# EAGLE design playa (EAGLE 6.4)
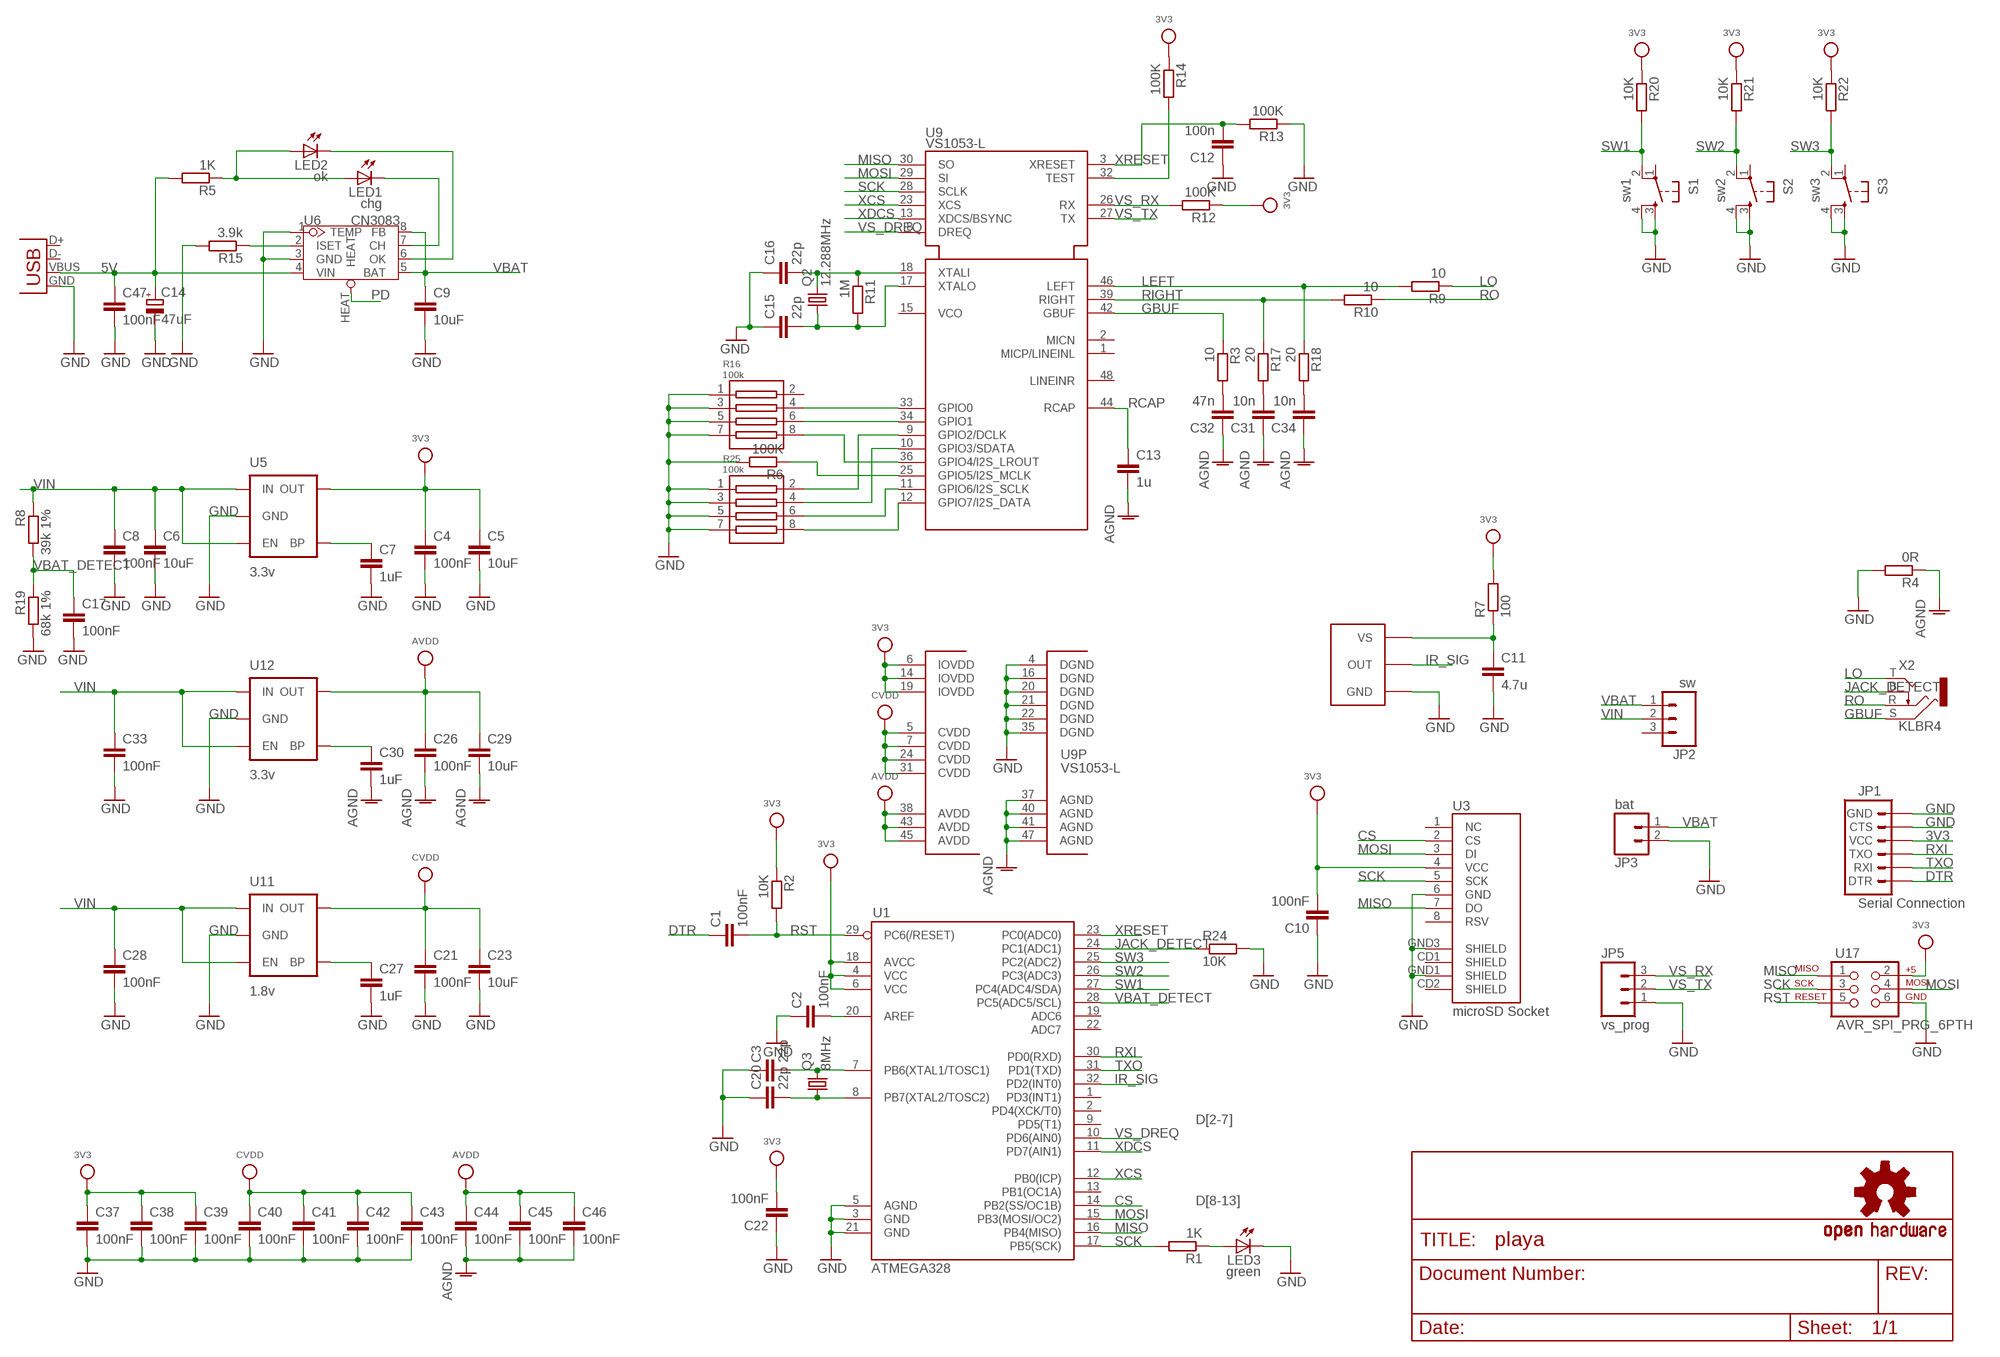
[diagram p0: schematic, sheet 1]

## Parts
C1  100nF  C-EUC0805  [C0805]
C2  100nF  C-EUC0805  [C0805]
C3  22p  C-EUC0805  [C0805]
C4  100nF  C-EUC0805  [C0805]
C5  10uF  C-EUC1206  [C1206]
C6  10uF  C-EUC1206  [C1206]
C7  1uF  C-EUC0805  [C0805]
C8  100nF  C-EUC0805  [C0805]
C9  10uF  C-EUC1206  [C1206]
C10  100nF  C-EUC0805  [C0805]
C11  4.7u  C-EUC1206  [C1206]
C12  100n  C-EUC0805  [C0805]
C13  1u  C-EUC0805  [C0805]
C14  47uF  CPOL-EUCT7343  [CT7343]
C15  22p  C-EUC0805  [C0805]
C16  22p  C-EUC0805  [C0805]
C17  100nF  C-EUC0805  [C0805]
C20  22p  C-EUC0805  [C0805]
C21  100nF  C-EUC0805  [C0805]
C22  100nF  C-EUC0805  [C0805]
C23  10uF  C-EUC1206  [C1206]
C26  100nF  C-EUC0805  [C0805]
C27  1uF  C-EUC0805  [C0805]
C28  100nF  C-EUC0805  [C0805]
C29  10uF  C-EUC1206  [C1206]
C30  1uF  C-EUC0805  [C0805]
C31  10n  C-EUC0805  [C0805]
C32  47n  C-EUC0805  [C0805]
C33  100nF  C-EUC0805  [C0805]
C34  10n  C-EUC0805  [C0805]
C37  100nF  C-EUC0805  [C0805]
C38  100nF  C-EUC0805  [C0805]
C39  100nF  C-EUC0805  [C0805]
C40  100nF  C-EUC0805  [C0805]
C41  100nF  C-EUC0805  [C0805]
C42  100nF  C-EUC0805  [C0805]
C43  100nF  C-EUC0805  [C0805]
C44  100nF  C-EUC0805  [C0805]
C45  100nF  C-EUC0805  [C0805]
C46  100nF  C-EUC0805  [C0805]
C47  100nF  C-EUC0805  [C0805]
JP1  Serial Connection  ARDUINO_SERIAL_PROGRAMPTH  [1X06]
JP2  sw  M03PTH  [1X03]
JP3  bat  M02PTH  [1X02]
JP5  vs_prog  M03PTH  [1X03]
LED1  chg  LEDCHIP-LED0805  [CHIP-LED0805]
LED2  ok  LEDCHIP-LED0805  [CHIP-LED0805]
LED3  green  LEDCHIP-LED0805  [CHIP-LED0805]
Q2  12.288MHz  CRYTAL  [CRYSTAL_5X3.2]
Q3  8MHz  CRYTAL  [CRYSTAL_5X3.2]
R1  1K  R-EU_R0805W  [R0805W]
R2  10K  R-EU_R0805W  [R0805W]
R3  10  R-EU_R0805W  [R0805W]
R4  0R  R-EU_R0805W  [R0805W]
R5  1K  R-EU_R0805W  [R0805W]
R6  100K  R-EU_R0805W  [R0805W]
R7  100  R-EU_R0805W  [R0805W]
R8  39k 1%  R-EU_R0805W  [R0805W]
R9  10  R-EU_R0805W  [R0805W]
R10  10  R-EU_R0805W  [R0805W]
R11  1M  R-EU_R0805W  [R0805W]
R12  100K  R-EU_R0805W  [R0805W]
R13  100K  R-EU_R0805W  [R0805W]
R14  100K  R-EU_R0805W  [R0805W]
R15  3.9k  R-EU_R0805W  [R0805W]
R16  100k  RES_ARR_1206  [RAS_ARR_1206]
R17  20  R-EU_R0805W  [R0805W]
R18  20  R-EU_R0805W  [R0805W]
R19  68k 1%  R-EU_R0805W  [R0805W]
R20  10K  R-EU_R0805W  [R0805W]
R21  10K  R-EU_R0805W  [R0805W]
R22  10K  R-EU_R0805W  [R0805W]
R24  10K  R-EU_R0805W  [R0805W]
R25  100k  RES_ARR_1206  [RAS_ARR_1206]
S1  sw1  TAC_SWITCHSMD  [TACTILE_SWITCH_SMD]
S2  sw2  TAC_SWITCHSMD  [TACTILE_SWITCH_SMD]
S3  sw3  TAC_SWITCHSMD  [TACTILE_SWITCH_SMD]
U1  ATMEGA328  ATMEGA168  [TQFP32-08]
U3  microSD Socket  USD-SOCKETNEW  [MICRO-SD-SOCKET-PP]
U5  3.3v  V_REG_LDOSMD  [SOT23-5]
U6  CN3083  [SOP8-W/-HEAT]
U9  VS1053-L  [LQFP48]
U11  1.8v  V_REG_LDOSMD  [SOT23-5]
U12  3.3v  V_REG_LDOSMD  [SOT23-5]
U17  AVR_SPI_PRG_6PTH  [2X3]
U$3  TSOP312X  [TSOP312X]
U$5  OSHW-LOGOM  [OSHW-LOGO-M]
X1  USBSMD  [USB-MINIB]
X2  KLBR4  [KLBR4]

## Nets
3V3: C4.1 C5.1 C10.2 C22.2 C37.1 C38.1 C39.1 JP1.4(VCC) R2.1 R7.2 R12.1 R14.1 R20.1 R21.1 R22.1 U1.4(VCC) U1.6(VCC) U1.18(AVCC) U3.4(VCC) U5.5(OUT) U9.6(IOVDD) U9.14(IOVDD) U9.19(IOVDD) U17.2
5V: C14.+ C47.1 R5.2 U6.4(VIN) X1.VBUS
AGND [vcc]: C13.2 C26.2 C29.2 C30.2 C31.1 C32.1 C34.1 C44.2 C45.2 C46.2 R4.1 U9.37(AGND) U9.40(AGND) U9.41(AGND) U9.47(AGND)
AVDD: C26.1 C29.1 C44.1 C45.1 C46.1 U9.38(AVDD) U9.43(AVDD) U9.45(AVDD) U12.5(OUT)
CS: U1.14(PB2(SS/OC1B)) U3.2(CS)
CVDD: C21.1 C23.1 C40.1 C41.1 C42.1 C43.1 U9.5(CVDD) U9.7(CVDD) U9.24(CVDD) U9.31(CVDD) U11.5(OUT)
DTR: C1.1 JP1.1(DTR)
GBUF: R3.1 U9.42(GBUF) X2.S
GND [vcc]: C2.1 C3.1 C4.2 C5.2 C6.2 C7.2 C8.2 C9.2 C10.1 C11.2 C12.1 C14.- C15.1 C16.1 C17.2 C20.1 C21.2 C22.1 C23.2 C27.2 C28.2 C33.2 C37.2 C38.2 C39.2 C40.2 C41.2 C42.2 C43.2 C47.2 JP1.5(CTS) JP1.6(GND) JP3.2 JP5.1 LED3.C R4.2 R6.2 R13.1 R15.2 R16.1 R16.3 R16.5 R16.7 R19.2 R24.2 R25.1 R25.3 R25.5 R25.7 S1.3 S1.4 S2.3 S2.4 S3.3 S3.4 U1.3(GND) U1.5(AGND) U1.21(GND) U3.6(GND) U3.GND1(SHIELD) U3.GND3(SHIELD) U5.2(GND) U6.1(TEMP) U6.3(GND) U9.4(DGND) U9.16(DGND) U9.20(DGND) U9.21(DGND) U9.22(DGND) U9.35(DGND) U11.2(GND) U12.2(GND) U17.6 U$3.1(GND) X1.GND
IR_SIG: U1.32(PD2(INT0)) U$3.3(OUT)
JACK_DETECT: R24.1 U1.24(PC1(ADC1)) X2.B
LEFT: R9.2 R18.1 U9.46(LEFT)
LO: R9.1 X2.T
MISO: U1.16(PB4(MISO)) U3.7(DO) U9.30(SO) U17.1
MOSI: U1.15(PB3(MOSI/OC2)) U3.3(DI) U9.29(SI) U17.4
N$1: C20.2 Q3.P$1 U1.8(PB7(XTAL2/TOSC2))
N$2: C3.2 Q3.P$2 U1.7(PB6(XTAL1/TOSC1))
N$3: C2.2 U1.20(AREF)
N$4: R16.4 U9.33(GPIO0)
N$5: C7.1 U5.4(BP)
N$6: R25.8 U9.12(GPIO7/I2S_DATA)
N$7: C27.1 U11.4(BP)
N$8: C32.2 R3.2
N$9: R15.1 U6.2(ISET)
N$10: C31.2 R17.2
N$11: C34.2 R18.2
N$12: R16.6 U9.34(GPIO1)
N$13: LED3.A R1.1
N$14: LED1.A LED2.A R5.1
N$15: LED1.C U6.7(CH)
N$16: LED2.C U6.6(OK)
N$17: R16.8 U9.36(GPIO4/I2S_LROUT)
N$19: C30.1 U12.4(BP)
N$20: R6.1 U9.25(GPIO5/I2S_MCLK)
N$21: R25.2 U9.9(GPIO2/DCLK)
N$22: R25.4 U9.10(GPIO3/SDATA)
N$23: R25.6 U9.11(GPIO6/I2S_SCLK)
N$24: C11.1 R7.1 U$3.2(VS)
N$47: R14.2 U9.32(TEST)
PD: U6.HEAT
RCAP: C13.1 U9.44(RCAP)
RIGHT: R10.2 R17.1 U9.39(RIGHT)
RO: R10.1 X2.R
RST: C1.2 R2.2 U1.29(PC6(/RESET)) U17.5
RXI: JP1.3(TXO) U1.30(PD0(RXD))
SCK: R1.2 U1.17(PB5(SCK)) U3.5(SCK) U9.28(SCLK) U17.3
SW1: R20.2 S1.2 U1.27(PC4(ADC4/SDA))
SW2: R21.2 S2.2 U1.26(PC3(ADC3))
SW3: R22.2 S3.2 U1.25(PC2(ADC2))
TXO: JP1.2(RXI) U1.31(PD1(TXD))
VBAT: C9.1 JP2.1 JP3.1 U6.5(BAT) U6.8(FB)
VBAT_DETECT: C17.1 R8.2 R19.1 U1.28(PC5(ADC5/SCL))
VIN: C6.1 C8.1 C28.1 C33.1 JP2.2 R8.1 U5.1(IN) U5.3(EN) U11.1(IN) U11.3(EN) U12.1(IN) U12.3(EN)
VS_DREQ: U1.10(PD6(AIN0)) U9.8(DREQ)
VS_RX: JP5.3 R12.2 U9.26(RX)
VS_TX: JP5.2 U9.27(TX)
VS_XTALI: C16.2 Q2.P$2 R11.1 U9.18(XTALI)
VS_XTALO: C15.2 Q2.P$1 R11.2 U9.17(XTALO)
XCS: U1.12(PB0(ICP)) U9.23(XCS)
XDCS: U1.11(PD7(AIN1)) U9.13(XDCS/BSYNC)
XRESET: C12.2 R13.2 U1.23(PC0(ADC0)) U9.3(XRESET)
Unconnected: JP2.3 R16.2 S1.1 S2.1 S3.1 U1.1(PD3(INT1)) U1.2(PD4(XCK/T0)) U1.9(PD5(T1)) U1.13(PB1(OC1A)) U1.19(ADC6) U1.22(ADC7) U3.1(NC) U3.8(RSV) U3.CD1(SHIELD) U3.CD2(SHIELD) U9.1(MICP/LINEINL) U9.2(MICN) U9.15(VCO) U9.48(LINEINR) X1.D+ X1.D-

## Notes on the sheet
- D[2-7]
- D[8-13]

## Library data of the parts
C1-C13 C15-C17 C20-C23 C26-C34 C37-C47 = rcl:C-EU: CAPACITOR, European symbol
C14 = rcl:CPOL-EU: POLARIZED CAPACITOR, European symbol
JP1 = SparkFun:ARDUINO_SERIAL_PROGRAM
JP2 JP5 = SparkFun:M03: Header 3 Standard 3-pin 0.1" header. Use with straight break away headers (SKU : PRT-00116), right angle break away headers (PRT-00553), swiss pins (PRT-00743), machine pins (PRT-00117), and female headers (PRT-00115). Molex polarized connector foot print use with SKU : PRT-08232 with associated crimp pins and housings.
JP3 = SparkFun:M02: Header 2 Standard 2-pin 0.1" header. Use with straight break away headers (SKU : PRT-00116), right angle break away headers (PRT-00553), swiss pins (PRT-00743), machine pins (PRT-00117), and female headers (PRT-00115). Molex polarized connector foot print use with SKU : PRT-08233 with associated crimp pins and housings.
LED1-LED3 = led:LED: LED OSRAM: - CHIPLED LG R971, LG N971, LY N971, LG Q971, LY Q971, LO R971, LY R971 LH N974, LH R974 LS Q976, LO Q976, LY Q976 LO Q996 - Hyper CHIPLED LW Q18S LB Q993, LB Q99A, LB R99A - SideLED LS A670, LO A670, LY A670, LG A670, LP A670 LB A673, LV A673, LT A673, LW A673 LH A674 LY A675 LS A676, LA A676, LO A676, LY A676, LW A676 LS A679, LY A679, LG A679 - Hyper Micro SIDELED® LS Y876, LA Y876, LO Y876, LY Y876 LT Y87S - SmartLED LW L88C, LW L88S LB L89C, LB L89S, LG L890 LS L89K, LO L89K, LY L89K LS L896, LA L896, LO L896, LY L896 - TOPLED LS T670, LO T670, LY T670, LG T670, LP T670 LSG T670, LSP T670, LSY T670, LOP T670, LYG T670 LG T671, LOG T671, LSG T671 LB T673, LV T673, LT T673, LW T673 LH T674 LS T676, LA T676, LO T676, LY T676, LB T676, LH T676, LSB T676, LW T676 LB T67C, LV T67C, LT T67C, LS T67K, LO T67K, LY T67K, LW E67C LS E67B, LA E67B, LO E67B, LY E67B, LB E67C, LV E67C, LT E67C LW T67C LS T679, LY T679, LG T679 LS T770, LO T770, LY T770, LG T770, LP T770 LB T773, LV T773, LT T773, LW T773 LH T774 LS E675, LA E675, LY E675, LS T675 LS T776, LA T776, LO T776, LY T776, LB T776 LHGB T686 LT T68C, LB T68C - Hyper Mini TOPLED® LB M676 - Mini TOPLED Santana® LG M470 LS M47K, LO M47K, LY M47K Source: http://www.osram.convergy.de/
Q2 Q3 = Omat_komponentit:CRYTAL: CRYSTAL
R1-R15 R17-R22 R24 = rcl:R-EU_: RESISTOR, European symbol
R16 R25 = Omat_komponentit:RES_ARR_1206
S1-S3 = SparkFun:TAC_SWITCH: Momentary Switch Button commonly used for reset or general input. Spark Fun Electronics SKU : COM-00097
U1 = SparkFun:ATMEGA168
U3 = SparkFun:USD-SOCKET: microSD Socket Push-push type uSD socket. Schematic element and footprint production proven. Spark Fun Electronics SKU : PRT-00127. tDoc lines correctly indicate media card edge positions when inserting (unlocked, locked, depressed).
U5 U11 U12 = SparkFun:V_REG_LDO: Voltage Regulator LDO Standard 150mA LDO voltage regulator in SOT-23 layout. Micrel part MIC5205. BP (by-pass) pin is used to lower output noise with 470pF cap.
U6 = IC:CN3083
U9 = vlsi:VS1053
U17 = SparkFun:AVR_SPI_PRG_6: AVR ISP 6 Pin This is the reduced ISP connector for AVR programming. Common on Arduino. This footprint will take up less PCB space and can be used with a 10-pin to 6-pin adapter such as SKU: BOB-08508
U$3 = tsop:TSOP312X: TSOP ir receiver module for remote control systems
U$5 = SparkFun:OSHW-LOGO: Open Source Hardware Logo This logo indicates the piece of hardware it is found on incorporates a OSHW license and/or adheres to the definition of open source hardware found here: http://freedomdefined.org/OSHW
X1 = SparkFun:USB: USB Connectors USB-B-PTH is fully proven SKU : PRT-00139 USB-miniB is fully proven SKU : PRT-00587 USB-A-PCB is untested. USB-A-H is throughly reviewed, but untested. Spark Fun Electronics SKU : PRT-00437 USB-B-SMT is throughly reviewed, but untested. Needs silkscreen touching up. USB-A-S has not been used/tested USB-MB-H has not been used/tested
X2 = mine:KLBR4: Jack connectors according to JISC 6560, 3.5 mm Klinkeneinbaukupplung nach JISC 6560, 3,5 mm, 3-polig/ stereo, abgewinkelte Ausführung, mit Öffner, für Leiterplatten Source: http://www.lumberg.com/Produkte/PDFs/KLBR4.pdf; MPN: KLBR 4; OC_FARNELL: 1217016; OC_NEWARK: 97K2709

## Net classes
0 default: width 0.178 mm
1 vcc: width 0.203 mm

## Board
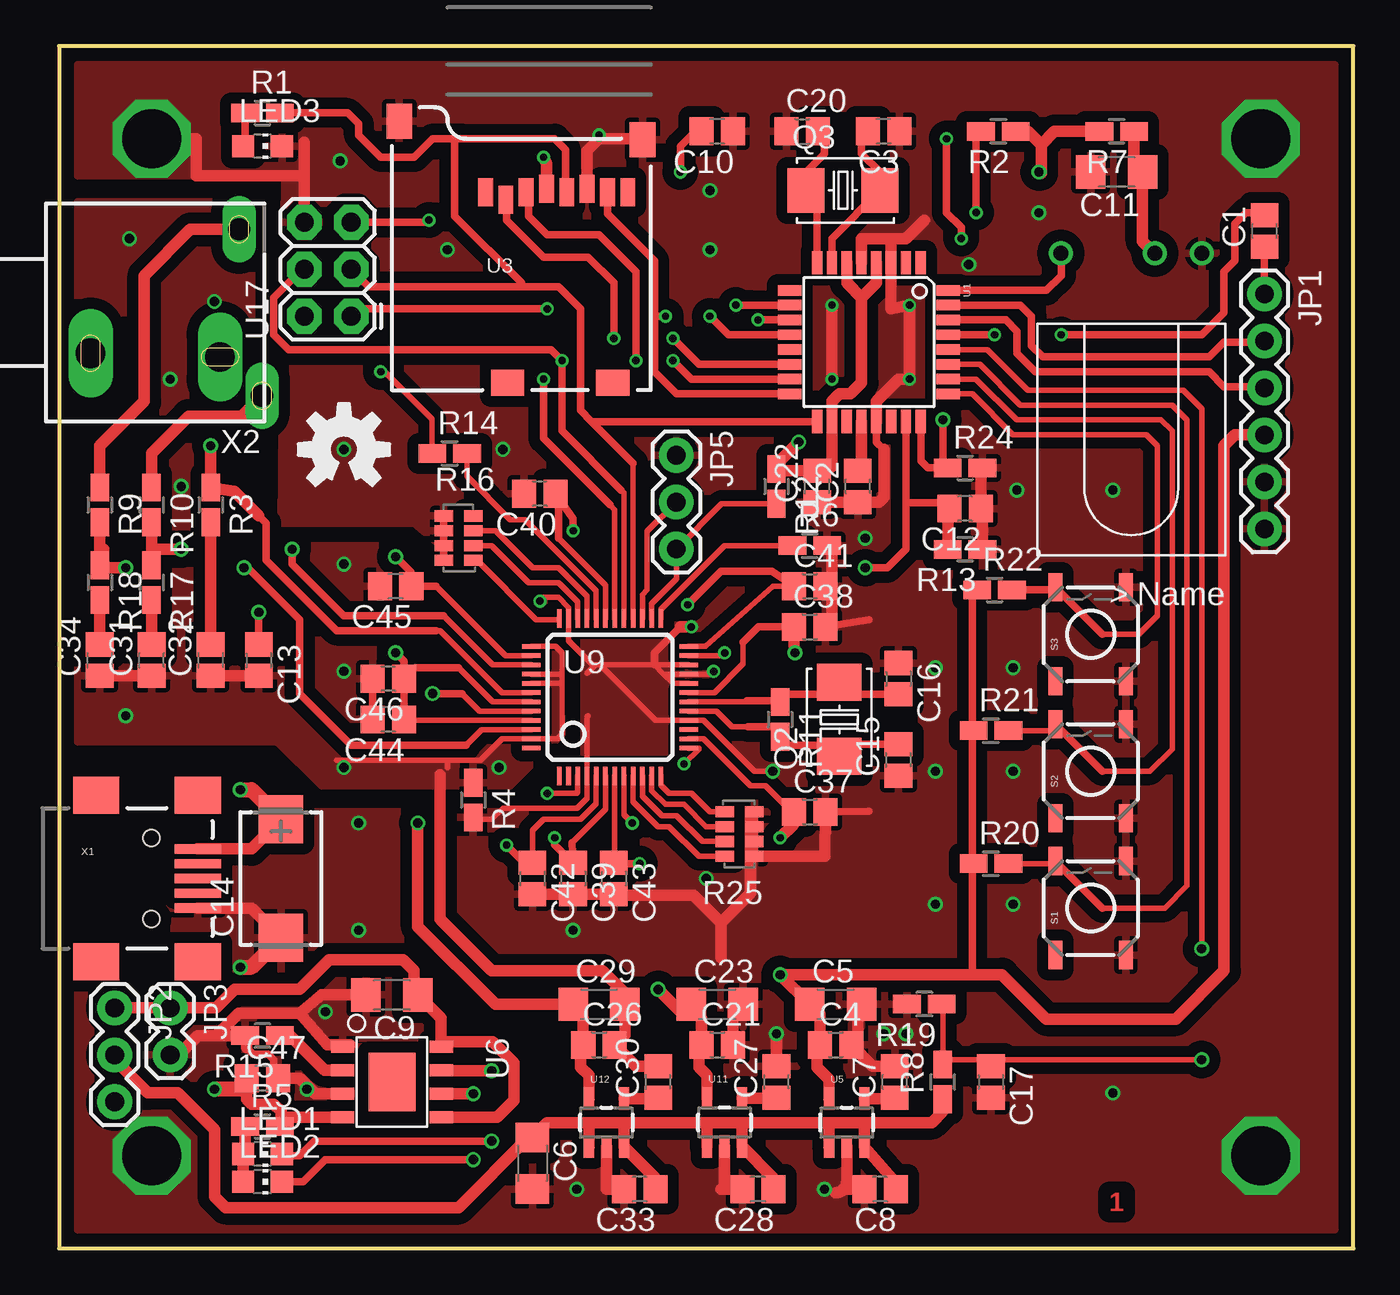
[diagram p1: board, top side]
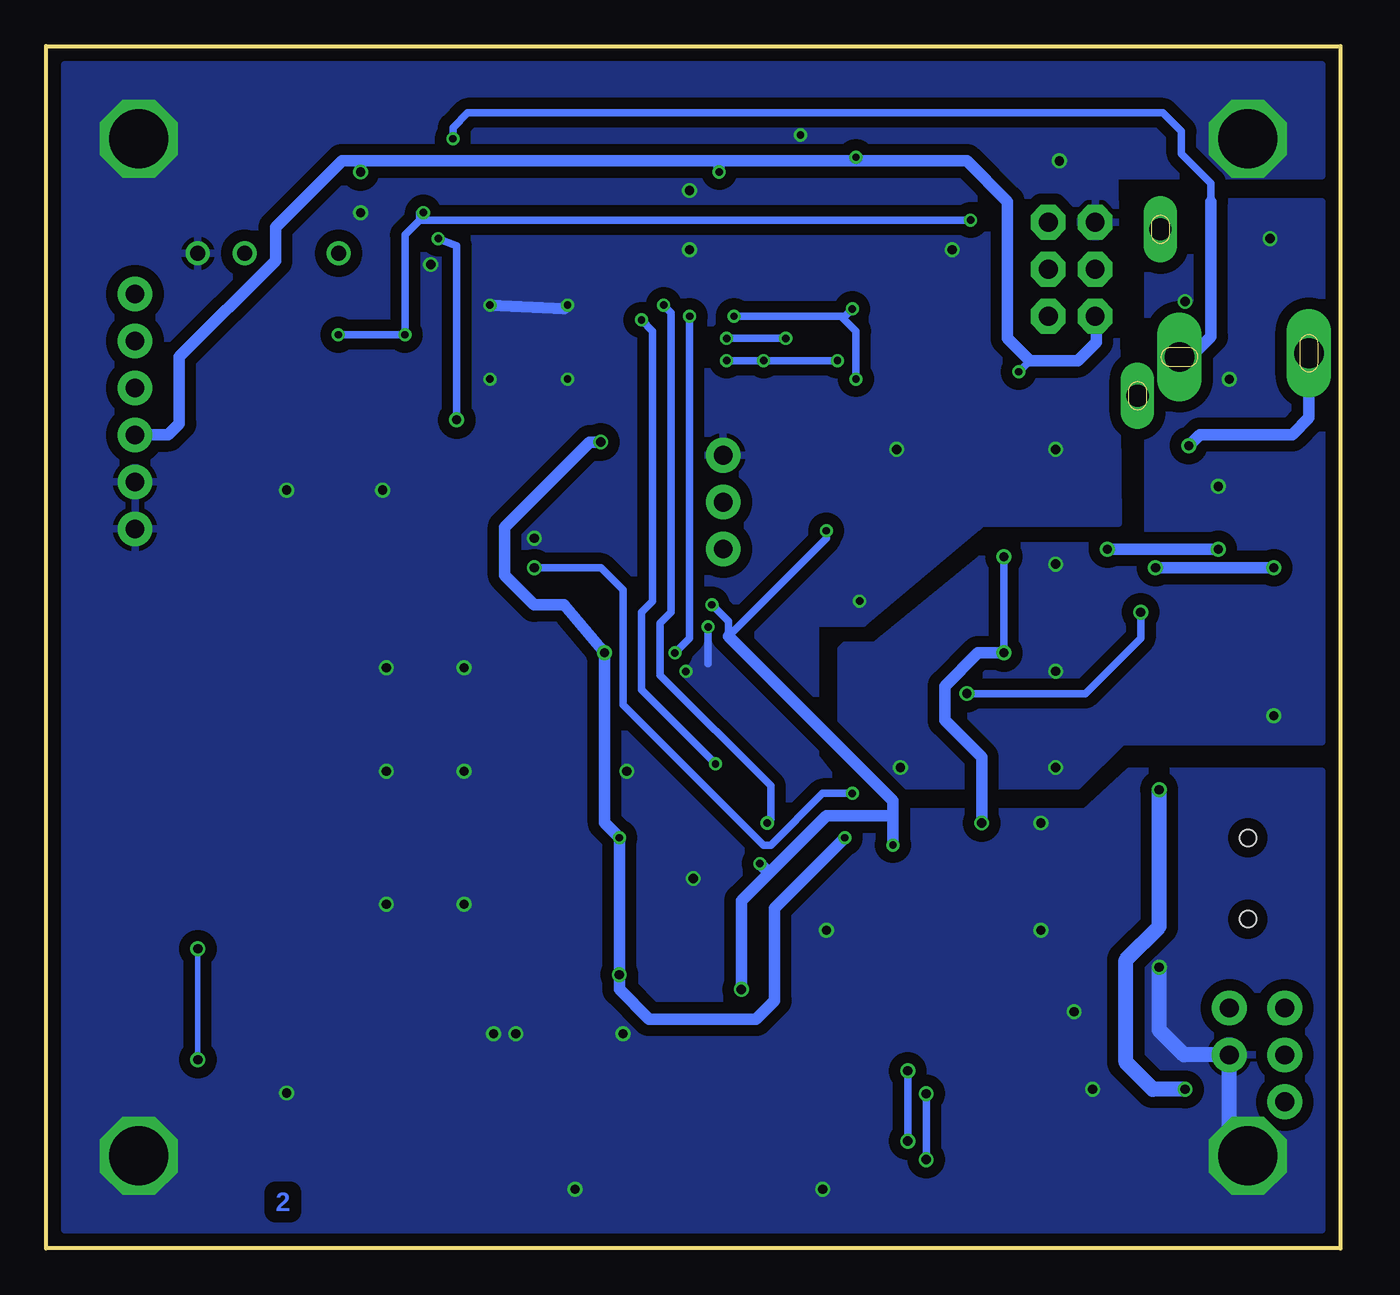
[diagram p2: board, bottom side, seen from below]

Size 70 x 65 mm. Coordinates in mm from the lower left corner, seen from the top.
Outline: 70,0 70,65 0,65 0,0 70,0
Copper layers (1*16): Top 0.035mm / dielectric 1.5mm / Bottom 0.035mm
Design rules "default": minimum track width 6mil, minimum drill 12mil, track to track 6mil, track to pad 6mil, pad to pad 6mil, via to via 6mil, smd to smd 0mil, copper to edge 10mil, drill to drill 10mil, minimum pad ring 10mil, minimum via ring 6mil, stop-mask expansion 2mil, vias tented up to drill 100mil, thermal gap 10mil

### Footprints (pad centres in the part's own frame; a part is rotated, then mirrored left to right if it is on the bottom)
C0805 = smd 1.3 x 1.5: 1 -0.85,0; 2 0.85,0
C1206 = smd 1.6 x 1.8: 1 -1.4,0; 2 1.4,0
CT7343 = smd 2.6 x 2.4: + 3.2,0; - -3.2,0
1X06 = drill 1.016 pad 1.88: 1 0,0; 2 2.54,0; 3 5.08,0; 4 7.62,0; 5 10.16,0; 6 12.7,0
1X03 = drill 1.016 pad 1.88: 1 0,0; 2 2.54,0; 3 5.08,0
1X02 = drill 1.016 pad 1.88: 1 0,0; 2 2.54,0
CHIP-LED0805 = smd 1.2 x 1.2: A 0,-1.05; C 0,1.05
CRYSTAL_5X3.2 = smd 2 x 2.4: P$1 -2,0; P$2 2,0
R0805W = smd 1.5 x 1: 1 -0.94,0; 2 0.94,0
RAS_ARR_1206 = smd 1 x 0.6: 1 -0.8,1.2; 2 0.8,1.2; 3 -0.8,0.4; 4 0.8,0.4; 5 -0.8,-0.4; 6 0.8,-0.4; 7 -0.8,-1.2; 8 0.8,-1.2
TACTILE_SWITCH_SMD = smd 1.524 x 0.762: 1 -2.54,1.905; 2 2.54,1.905; 3 -2.54,-1.905; 4 2.54,-1.905
TQFP32-08 = smd 1.27 x 0.559: 1 -4.293,2.8; 2 -4.293,2; 3 -4.293,1.2; 4 -4.293,0.4; 5 -4.293,-0.4; 6 -4.293,-1.2; 7 -4.293,-2; 8 -4.293,-2.8; 17 4.293,-2.8; 18 4.293,-2; 19 4.293,-1.2; 20 4.293,-0.4; 21 4.293,0.4; 22 4.293,1.2; 23 4.293,2; 24 4.293,2.8 | smd 0.559 x 1.27: 9 -2.8,-4.293; 10 -2,-4.293; 11 -1.2,-4.293; 12 -0.4,-4.293; 13 0.4,-4.293; 14 1.2,-4.293; 15 2,-4.293; 16 2.8,-4.293; 25 2.8,4.293; 26 2,4.293; 27 1.2,4.293; 28 0.4,4.293; 29 -0.4,4.293; 30 -1.2,4.293; 31 -2,4.293; 32 -2.8,4.293
MICRO-SD-SOCKET-PP = smd 0.8 x 1.5: 1 -8.94,10.7; 2 -7.84,10.3; 3 -6.74,10.7; 4 -5.64,10.9; 5 -4.54,10.7; 6 -3.44,10.9; 7 -2.34,10.7; 8 -1.24,10.7 | smd 1.8 x 1.4: CD1 -2.05,0.4; CD2 -7.75,0.4 | smd 1.4 x 1.9: GND1 -13.6,14.55; GND3 -0.45,13.55
SOT23-5 = smd 0.55 x 1.2: 1 -0.95,-1.3; 2 0,-1.3; 3 0.95,-1.3; 4 0.95,1.3; 5 -0.95,1.3
SOP8-W/-HEAT = smd 0.635 x 1.27: 1 -1.905,-2.667; 2 -0.635,-2.667; 3 0.635,-2.667; 4 1.905,-2.667; 5 1.905,2.667; 6 0.635,2.667; 7 -0.635,2.667; 8 -1.905,2.667 | smd 3.175 x 2.54: HEAT 0,0
LQFP48 = smd 0.25 x 1: 1 -2.75,-4.25; 2 -2.25,-4.25; 3 -1.75,-4.25; 4 -1.25,-4.25; 5 -0.75,-4.25; 6 -0.25,-4.25; 7 0.25,-4.25; 8 0.75,-4.25; 9 1.25,-4.25; 10 1.75,-4.25; 11 2.25,-4.25; 12 2.75,-4.25; 25 2.75,4.25; 26 2.25,4.25; 27 1.75,4.25; 28 1.25,4.25; 29 0.75,4.25; 30 0.25,4.25; 31 -0.25,4.25; 32 -0.75,4.25; 33 -1.25,4.25; 34 -1.75,4.25; 35 -2.25,4.25; 36 -2.75,4.25 | smd 1 x 0.25: 13 4.25,-2.75; 14 4.25,-2.25; 15 4.25,-1.75; 16 4.25,-1.25; 17 4.25,-0.75; 18 4.25,-0.25; 19 4.25,0.25; 20 4.25,0.75; 21 4.25,1.25; 22 4.25,1.75; 23 4.25,2.25; 24 4.25,2.75; 37 -4.25,2.75; 38 -4.25,2.25; 39 -4.25,1.75; 40 -4.25,1.25; 41 -4.25,0.75; 42 -4.25,0.25; 43 -4.25,-0.25; 44 -4.25,-0.75; 45 -4.25,-1.25; 46 -4.25,-1.75; 47 -4.25,-2.25; 48 -4.25,-2.75
2X3 = drill 1.016 pad 1.88 octagon: 1 0,0; 2 0,2.54; 3 2.54,0; 4 2.54,2.54; 5 5.08,0; 6 5.08,2.54
TSOP312X = drill 0.8: 1 0,0; 2 2.54,0; 3 7.62,0
USB-MINIB = smd 2.5 x 0.5: D+ 2.5,0; D- 2.5,0.8; GND 2.5,-1.6; ID 2.5,-0.8; VBUS 2.5,1.6 | smd 2.5 x 2: GND@1 -3,-4.5; GND@2 -3,4.5; GND@3 2.5,4.5; GND@4 2.5,-4.5 | hole 0.9: 0,2.2; 0,-2.2
KLBR4 = drill 1.6 pad 1.778 long: B -2.4,-3.5; S -2.2,3.5 | drill 1.2 pad 1.422 long: R -4.5,-5.77; T 4.5,-4.53

### Placement (x,y rotation side)
C1  65.2,55 90 top
C2  43.2,41.2 90 top
C3  44.6,60.4 180 top
C4  42,11 0 top
C5  42,13.2 0 top
C6  25.6,4.6 270 top
C7  45.2,9 90 top
C8  44.4,3.2 180 top
C9  18,13.7 180 top
C10  35.6,60.4 180 top
C11  57.2,58.2 180 top
C12  49,40 180 top
C13  10.8,31.8 270 top
C14  12,20 90 top
C15  45.4,26.4 90 top
C16  45.4,30.8 270 top
C17  50.4,9 270 top
C20  40.2,60.4 0 top
C21  35.6,11 0 top
C22  41,41.2 90 top
C23  35.6,13.2 0 top
C26  29.2,11 0 top
C27  38.8,9 90 top
C28  37.8,3.2 180 top
C29  29.2,13.2 0 top
C30  32.4,9 90 top
C31  5,31.8 90 top
C32  8.2,31.8 90 top
C33  31.4,3.2 180 top
C34  2.2,31.8 90 top
C37  40.6,23.6 0 top
C38  40.6,33.6 0 top
C39  27.8,20 270 top
C40  26,40.8 180 top
C41  40.6,35.8 0 top
C42  25.6,20 270 top
C43  30,20 270 top
C44  17.8,28.6 180 top
C45  18.2,35.8 180 top
C46  17.8,30.8 180 top
C47  11,9.2 0 top
JP1  65.2,51.6 270 top
JP2  3,13 270 top
JP3  6,13 270 top
JP5  33.38,42.89 270 top
LED1  11,5.1 270 top
LED2  11,3.6 270 top
LED3  11,59.6 270 top
Q2  42.2,28.6 90 top
Q3  42.4,57.2 0 top
R1  11,61.4 0 top
R2  50.8,60.4 180 top
R3  8.2,40.2 270 top
R4  22.4,24.24 270 top
R5  11,6.6 0 top
R6  40.6,38 0 top
R7  57.2,60.4 180 top
R8  47.8,9 90 top
R9  2.2,40.2 270 top
R10  5,40.2 270 top
R11  39,28.6 270 top
R12  38.8,41.2 270 top
R13  49,37.8 180 top
R14  21.12,42.98 0 top
R15  11,11.5 180 top
R16  21.6,38.4 0 top
R17  5,36 270 top
R18  2.2,36 270 top
R19  46.8,13.2 180 top
R20  50.4,20.8 0 top
R21  50.4,28 0 top
R22  50.6,35.6 0 top
R24  49,42.2 0 top
R25  36.8,22.4 180 top
S1  55.8,18.4 90 top
S2  55.8,25.8 90 top
S3  55.8,33.2 90 top
U1  43.8,49 270 top
U3  32,46.4 0 top
U5  42.6,6.8 0 top
U6  18,9 270 top
U9  29.8,29.8 0 top
U11  35.99,6.81 0 top
U12  29.6,6.8 0 top
U17  15.8,50.4 90 top
U$3  61.8,53.8 180 top
U$5  15.4,43.2 0 top
X1  5,20 0 top
X2  5.2,50.6 90 top

### Tracks (layer width: path | path; a pad name or v marks a point on that pad's centre or on a via)
3V3  (via drill 0.4, 0.5)
  Top 0.305: U9.6 29.55,23.75 27.73,21.93 | U9.19 35.45,30.05 37,31.6 37,32.77 | U9.14 34.85,27.55 37.4,25 38.2,25 39.6,23.6 C37.1 | v17.4,47.4 17.6,47.4 20.18,44.82 R14.1
  Top 0.4: v26.8,22.2 26.8,21.82 C39.1
  Top 0.406: v33.6,58.2 33.6,59.6 34.2,60.2 C10.2 | C38.1 37.83,33.6 37,32.77 | C39.1 27.73,21.93 | v53,58.2 53.12,58.12 | R21.1 49.66,28.2 49.4,28.2 | 49.4,20.8 49.4,28.2 | 49.4,28.2 49.4,35.34 R22.1 | 49.4,20.8 R20.1 | 49.4,14.8 49.4,20.8
  Top 0.61: U1.6 42.6,52.2 43.4,51.4 | 43.4,51.4 44.2,52.2 U1.4 | 43.4,51.4 43.4,46.8 42.8,46.2 42.2,46.2 41.8,45.8 U1.18 41.8,42.45 C22.2 | v26.2,59 26.36,58.64 U3.4 | C22.2 41.8,42.25 | C38.1 39.75,32.65 v39.8,32.2 | C22.2 39.29,42.05 R12.1 38.8,42.4 v40,43.6 | C37.1 39.71,22.91 v39,22.2 | U5.5 41.65,9.15 41,9.8 41,10.96 C4.1 41.15,12.65 C5.1 v39,14.8 49.4,14.8 51,14.8 53.4,12.4 60.4,12.4 63,15 63,43.4 63.6,44 65.18,44 JP1.4 | 53.12,58.12 53.12,59.68 | 53.12,59.68 53.84,60.4 R7.2 | 53.12,59.68 52.4,60.4 R2.1
  Bottom 0.4: 16.8,48 v17.4,47.4
  Bottom 0.61: U17.2 13.2,50.34 13.2,49 14.2,48 16.8,48 18,49.2 18,56.6 20.2,58.8 26.2,58.8 | 33.6,58.8 v33.6,58.2 | 33.6,58.8 26.2,58.8 | 26.2,58.8 v26.2,59 | v26.8,22.2 30.6,18.4 30.6,13.4 31.6,12.4 37.4,12.4 39,14 v39,14.8 v39,22.2 39.8,23 v39.8,32.2 42,34.8 43.6,34.8 45.2,36.4 45.2,39 40.6,43.6 v40,43.6 | 53,58.8 33.6,58.8 | 53,58.8 v53,58.2 | 53,58.8 54,58.8 57.6,55.2 57.6,53.4 62.8,48.2 62.8,44.6 63.4,44 65.18,44 JP1.4
5V  (via drill 0.5)
  Top 0.61: X1.VBUS 10.4,21.6 C14.+ | U6.4 12.04,7.09 R5.2 12,6.86 12,7.4 11.6,7.8 10.4,7.8 10.15,8.05 10.15,8.6 C47.1
  Top 0.813: 10,8.6 10.15,8.6 10.15,9.25 | v9.8,24.8 10.4,24.8 C14.+ | 10,8.6 v8.4,8.6 | 10,8.6 10.2,8.8 10.2,9.2 10.15,9.25 | 10.15,9.25 10,9.4
  Bottom 0.813: v9.8,24.8 9.8,17.4 11.6,15.6 11.6,10.05 10.15,8.6 v8.4,8.6
AGND  (via drill 0.5)
  Top 0.305: U9.37 26.85,32.55 27.2,32.2 27.2,31 | 27.2,30.6 27.2,27.8 26.95,27.55 U9.47 23.95,27.55 22.8,26.4 21,26.4 | 27.2,30.6 27.2,31 | U9.40 27.15,31.05 27.2,31 | U9.41 27.15,30.55 27.2,30.6 | 10.85,31.35 10.8,31.35 C13.2 10.8,30.6 | 15,26.4 21,26.4 | 21,26.4 21,26
  Top 0.406: 30.6,13.8 30.6,13.42 | C44.2 C46.2
  Top 0.61: C34.1 C31.1 | C32.1 C13.2 | C30.2 31.2,9.85 C26.2 30.6,11.55 C29.2 30.6,13.42 | 30.6,13.8 29.4,15 23.4,15 20.6,17.8 20.6,25.6
  other vias: 15.4,37 15.4,31.2 15.4,26 23.8,26 3.8,54.6 6,47 8.4,51.2 6.6,41.2 3.6,28.8
  pour Top (isolate 0.61): 1,56.6 1,27.4 11.8,27.4 14.2,25 24.4,25 27.2,27.8 27,32.6 24.6,32.6 19,38 10.4,38 10.4,56.6
  pour Bottom (isolate 0.61): 1,27.4 11.8,27.4 14.2,25 24,25 27,28.2 27,32.4 26.8,32.6 25.2,32.6 18.6,38 10.4,38 10.4,56.6 1,56.6
AVDD  (via drill 0.5)
  Top 0.305: U9.45 19.3,28.55 C44.1 | U9.43 23.45,29.55 21.6,31.4 | C46.1 19.25,31.4 | U9.38 24.15,32.05 20.4,35.8
  Top 0.4: 19.25,31.4 21.6,31.4
  Top 0.406: C44.1 C46.1 18.65,31.75 v18.2,32.2 | 20.4,35.8 C45.1 19.05,36.55 v18.2,37.4
  Top 0.61: U12.5 28.65,9.35 28.2,9.8 28.2,10.85 C26.1 28.35,12.45 C29.1 23.6,13.2 19.4,17.4 v19.4,23
  Bottom 0.406: v18.2,32.2 v18.2,37.4
  Bottom 0.61: v18.2,32.2 19.6,32.2 21.4,30.4 21.4,28.55 19.4,26.55 v19.4,23
CS  (via drill 0.4)
  Top 0.4: 24.2,56.6 24.2,55.6 26.2,53.6 28.6,53.6 30,52.2 v30,49.2
  Top 0.406: U1.14 34.6,47.8 v33.2,49.2
  Top 0.61: 24.2,56.6 U3.2
  Bottom 0.4: v30,49.2 v33.2,49.2
CVDD  (via drill 0.4, 0.5)
  Top 0.305: U9.5 29.05,24.05 28.2,23.2 26.2,23.2 25.6,22.6 C42.1 | U9.24 34.95,32.55 38.6,35.8 C41.1 | U9.7 30.05,20.89 C43.1 | U9.31 29.55,35.85 27,38.4 | C40.1 27,40.75
  Top 0.4: v27.8,38.8 27.8,39.45 C40.1 | v31.4,20.8 30.14,20.8 | 27,40.75 27,38.4
  Top 0.406: C41.1 38.55,36.6 35.8,36.6 v34,34.8 | v24.2,21.8 25.11,20.89 C42.1
  Top 0.61: 30.14,20.8 30.05,20.89 | U11.5 35.04,9.36 34.6,9.8 34.6,10.85 C21.1 34.75,12.45 34.4,12.8 C23.1 33.6,12.8 v32.4,14
  Bottom 0.406: v27.8,38.8 27.8,38.4 33.1,33.1 33.1,33.9 v34,34.8
  Bottom 0.61: v32.4,14 32.4,18.8 30.8,20.4 | v31.4,20.8 31,20.4 30.8,20.4 | 33.1,33.1 24.2,24.2 24.2,23.4 | 24.2,23.4 v24.2,21.8 | 30.8,20.4 27.8,23.4 24.2,23.4
DTR
  Top 0.406: JP1.1 C1.1
GBUF  (via drill 0.5)
  Top 0.305: U9.42 23.95,30.05 20.6,33.4 20.4,33.4 | 10.8,39.6 11,39.4
  Top 0.406: 11,39.4 11.2,39.2 11.2,37.2 15,33.4 20.4,33.4
  Top 0.61: 10.8,39.6 9.46,40.94 R3.1 v8.2,43.4
  Bottom 0.61: v8.2,43.4 7.6,44 2.6,44 1.7,44.9 X2.S
GND  (via drill 0.4, 0.5, 3.2)
  Top 0.305: 29.25,31.55 32.2,31.55 | 32.2,31.55 U9.22 | 32.7,31.05 U9.21 35.25,31.05 arc90 v35.4,31.2 | 32.2,31.55 32.7,31.05 | U9.20 33.2,30.55 32.7,31.05 | 29,31.55 29.25,31.55 | 29,31.55 28.85,31.55 27.55,32.85 U9.35 27.55,34.65 27,35.2 26.2,35.2 v26,35 | 29.25,31.55 32.25,28.55 U9.16 34.85,28.55 37.6,25.8 v38.6,25.8 | 29,31.55 28.55,31.1 | 28.6,28.8 28.55,28.75 U9.4 28.55,24.35 28,23.8 24,23.8 23.4,23.2 22.6,23.2 22.4,23.4
  Top 0.4: 10.15,10.85 10.5,10.5 11.3,10.5 11.6,10.2 11.6,9.45
  Top 0.406: R25.1 R25.3 R25.5 R25.7 | R16.1 R16.3 R16.5 R16.7 | U1.21 44.2,43.6 44.6,43.2 | C37.2 43.8,23.63 | C38.2 43.8,34 | 33.6,33.6 32.2,32.2 32.2,31.55
  Top 0.6: 28.56,59.36 29.2,60
  Top 0.61: X1.GND 10.4,18.4 C14.- | JP3.2 6.46,10.46 7.5,11.5 8.5,11.5 | 8.5,11.5 9.7,12.7 13,12.7 | 13,12.7 14.5,11 15.74,11 U6.1 | 8.5,11.5 R15.2 10.15,11.41 10.15,10.85 | 11.6,9.45 C47.2 13,9.2 13.84,8.37 U6.3 | C9.2 14.2,13.7 13,12.7 | 45,10.05 C7.2 44,9.85 C4.2 43.2,11.55 43.2,13 C5.2 | C27.2 v38.8,11.6 | 13.26,58 U17.6 | 13.26,58 13.26,59.8 | 13.26,58 7.4,58 7.4,60 v5,60 | U3.6 28.56,59.36 | 29.2,60 31.5,60 U3.GND3 | U1.5 43.4,54.6 44.8,54.6 | 44.8,54.6 45,54.4 U1.3 45,50.8 v46,51 v46,47 45.4,47 44.2,45.8 U1.21 | v41.8,51 v41.8,47 | C42.2 C39.2 C43.2 30.02,19.1 34.3,19.1 35.8,17.6 | U12.2 29.6,3.2 C33.2 | C6.2 25.8,3.2 | 42.4,3.2 C8.2 | C28.2 35.79,3.2 arc90 35.99,3.4 U11.2 | 44.8,54.6 45.8,54.6 46.8,55.6 | C10.1 36.4,60.25 | 35.8,17.6 35.8,15.7 | 35.8,17.6 37.4,19.2 37.4,23.4 R25.7 | C37.2 41.41,21.2 R25.1 | 41.8,36.2 41.8,38 | 41.8,36.2 C41.2 | 41.8,36.2 41.8,34 C38.2 | 44.6,43.2 44.6,40.6 44.35,40.35 C2.1 C22.1 | U5.2 42.6,3.6 arc-90 42,3 | C21.2 36.45,12.85 C23.2 | C20.1 39.4,60.25 | C3.1 45.4,60.25 | R24.2 49.85,42.11 C12.1 49.94,39.91 R13.1 | 33.6,33.6 v34.2,33.6
  Top 0.813: v9.8,15.2 10.4,15.2 C14.-
  Bottom 0.406: v34.2,33.6 34.2,31.6
  Bottom 0.61: v41.8,51 42,50.8 v46,51
  Bottom 0.813: v9.8,15.2 9.8,11.8 8.46,10.46 JP3.2 6,6 v5,5
  other vias: 41.4,3.2 65,60 65,5 24,43.2 15.4,43.2 35,20 35.2,54 21,54 43.6,38.4 47.4,25.8 47.4,31.4 16.2,17.2 14.4,12.8 13.4,8.6 44.6,11.6 35.2,57.2 49.2,53.2 53,56 47.4,18.6 45.8,11.6 51.6,25.8 51.6,31.4 57,8.4 51.8,41 57,41 28,3.2 27.8,17.2 16.2,23 15.2,58.8 29.2,60.2 51.6,18.6
  pour Top (isolate 0.61): 1,25.8 1,1 69,1 69,64 1,64 1,58 12.2,58 12,39.2 19.2,39.2 25.6,33.8 28.4,33.8 28.4,26 26.2,23.6 13.8,23.6 11.4,25.8
  pour Bottom (isolate 0.61): 1,25.8 1,1 69,1 69,64 1,64 1,58 12.2,58 12,39.2 19.4,39.2 19.6,39 25.8,33.8 28.4,33.8 28.4,26.6 26,23.6 13.8,23.6 11.4,25.8
IR_SIG
  Top 0.406: U1.32 53.4,51.8 54.2,52.6 54.2,53.78 U$3.3
JACK_DETECT  (via drill 0.4, 0.5)
  Top 0.406: 46.6,43.6 U1.24 46.6,42.6 47,42.2 R24.1 47.8,42.2 v47.8,44.8 | v48,60 48,56 48.8,55.2 v48.8,54.6
  Bottom 0.406: v47.8,44.8 47.8,54.2 v48.8,54.6 | v48,60 48,60.6 47.2,61.4 9.6,61.4 8.6,60.4 8.6,59.2 7,57.6 7,56.6
  Bottom 0.61: 7,56.6 7,49.3 8.1,48.2 X2.B
LEFT  (via drill 0.5)
  Top 0.305: U9.46 22.85,28.05 22,27.2
  Top 0.4: 15.8,27.2 22,27.2
  Top 0.406: v10,36.8 10.2,36.8 13,34 13,30.6 13,30.4 13,30 15.8,27.2
  Top 0.61: R18.1 R9.2 | R18.1 2.4,37.8 | v3.6,36.8 2.54,36.8 R18.1
  Bottom 0.61: v3.6,36.8 v10,36.8
LO
  Top 0.61: R9.1 2.2,43.4 4.6,45.8 4.6,52.6 7.1,55.1 X2.T
MISO  (via drill 0.4)
  Top 0.305: U9.30 30.05,39.95 29.8,40.2
  Top 0.4: U1.16 33.4,46.2 32.2,47.4 32.2,50.4 | U3.7 29.66,55.94 32.2,53.4 32.2,50.4 | v26.4,50.8 16.2,50.8 | v32.8,50.4 32.2,50.4
  Top 0.406: 29.8,40.2 26.2,43.8 v26.2,47
  Top 0.61: 16.2,50.8 U17.1
  Bottom 0.406: 27,50.4 v32.8,50.4 | 27,50.4 26.2,49.6 v26.2,47 | 27,50.4 26.8,50.4 v26.4,50.8
MOSI  (via drill 0.4)
  Top 0.305: U9.29 30.55,40.85 30.4,41
  Top 0.4: 25.4,56.8 25.4,55.8 26.4,54.8 29.2,54.8 31.2,52.8 v31.2,48 | 13.14,52.94 11.6,51.4 11.6,49.4 12.4,48.6 26.4,48.6 | v27.2,48 27.2,44.2
  Top 0.406: U1.15 34.2,47 v33.2,48 | 25.4,56.8 25.2,57 | 27.2,44.2 30.4,41 | 26.4,48.6 26.6,48.6 v27.2,48
  Top 0.61: 25.2,57 U3.3 | 13.14,52.94 U17.4
  Bottom 0.4: v33.2,48 v31.2,48 v27.2,48
N$1
  Top 0.406: U1.8 41,56.4 | 40.45,57.25 40.45,58.25 41.4,59.2 41.4,60.15
  Top 0.61: 40.45,57.25 Q3.P$1 40.4,57 41,56.4 | 41.4,60.15 C20.2
N$2
  Top 0.406: U1.7 41.8,54.6 Q3.P$2 44.4,58.2 43.4,59.2 43.4,60.15
  Top 0.61: 43.4,60.15 C3.2
N$3
  Top 0.61: U1.20 43.4,42.25 C2.2
N$4
  Top 0.305: U9.33 28.55,35.25 27,36.8 25.6,36.8 23.6,38.8 R16.4
N$5
  Top 0.61: C7.1 45.6,8.1 U5.4
N$6
  Top 0.305: U9.12 32.55,25.05 33,24.6 34.2,24.6 35.2,23.6 R25.8
N$7
  Top 0.61: U11.4 38.76,8.11 arc90 C27.1
N$8
  Top 0.61: C32.2 R3.2
N$9
  Top 0.61: U6.2 14.37,9.63 12.5,11.5 R15.1
N$10
  Top 0.61: C31.2 R17.2
N$11
  Top 0.61: C34.2 R18.2
N$12
  Top 0.305: U9.34 28.05,34.95 27,36 25.4,36 23.4,38 R16.6
N$13
  Top 0.4: 10.06,59.91 R1.1
  Top 0.61: LED3.A 10.06,59.91
N$14
  Top 0.61: R5.1 10.06,5.61 LED1.A LED2.A
N$15  (via drill 0.5)
  Top 0.406: v23.4,5.8 13.8,5.8 13,5 12.15,5 LED1.C
  Top 0.61: LED1.C 12.2,5.4 | v23.4,9.6 21,9.6 U6.7 20.8,9.63 20.8,9.6
  Bottom 0.406: v23.4,5.8 v23.4,9.6
N$16  (via drill 0.5)
  Top 0.406: v22.4,4.8 14.4,4.8 13.2,3.6 LED2.C
  Top 0.61: v22.4,8.37 U6.6
  Bottom 0.406: v22.4,4.8 v22.4,8.37
N$17
  Top 0.305: R16.8 22.6,37.2 25.8,34 27,34 U9.36
N$19
  Top 0.61: C30.1 32.4,8.1 U12.4
N$20
  Top 0.305: U9.25 32.55,34.55 36,38 R6.1
N$21
  Top 0.305: U9.9 31.05,24.15 32.4,22.8 33,22.8 34.6,21.2 R25.2
N$22
  Top 0.305: U9.10 31.55,24.45 32.6,23.4 33.4,23.4 34.8,22 R25.4
N$23
  Top 0.305: U9.11 32.05,24.75 32.8,24 33.8,24 35,22.8 R25.6
N$24
  Top 0.61: R7.1 58.14,58.66 C11.1 58.6,54.46 U$3.2
N$47
  Top 0.305: U9.32 29.05,35.55 25.2,39.4 24.4,39.4 22.06,41.74 R14.2
RCAP  (via drill 0.5)
  Top 0.305: U9.44 22.75,29.05 21.8,30
  Top 0.4: v20.2,30 21.8,30
  Top 0.406: C13.1 v10.8,34.4
  Bottom 0.4: 13.8,30 v20.2,30
  Bottom 0.406: v10.8,34.4 10.8,33.8 10.8,33 13.8,30
RIGHT  (via drill 0.5)
  Top 0.305: U9.39 23.45,31.55 20.8,34.2
  Top 0.406: v12.6,37.8 12.6,37 14.8,34.8 15.4,34.2 20.8,34.2
  Top 0.61: R10.2 R17.1 5.2,37.8 v6.6,37.8
  Bottom 0.61: v6.6,37.8 v12.6,37.8
RO
  Top 0.61: R10.1 5,43 7,45 9.87,45 X2.R
RST  (via drill 0.4)
  Top 0.4: U17.5 19.72,55.48 | v50.6,49.4 U1.29
  Top 0.406: v49.6,56 49.6,60.2 | 19.72,55.48 19.88,55.48 v20,55.6 | v54.2,49.4 61.8,49.4 63,50.6 63,52.8 63.6,53.4 63.6,55.4 64.2,56 65.05,56 C1.2 64.95,56
  Top 0.61: 49.6,60.2 R2.2
  Bottom 0.4: 32.8,55.6 49.8,55.6 | v50.6,49.4 v54.2,49.4
  Bottom 0.406: v20,55.6 32.8,55.6 | v50.6,49.4 50.6,54.8 49.8,55.6 49.8,56 v49.6,56
RXI
  Top 0.406: U1.30 51.2,50.2 51.8,49.6 51.8,48.4 52.8,47.4 62.2,47.4 63,46.6 65.12,46.6 JP1.3
SCK
  Top 0.305: 31,44.71 31.05,44.66 | U9.28 31.05,42.46
  Top 0.4: R1.2 15.6,61.4 16.2,60.8 16.2,60.2 17.4,59 19.2,59 | 20.2,60 21.8,60 26.8,60 27.4,59.4 27.4,57.16 | 28.2,50.8 27,52 25,52 16.74,52 U17.3 | 31,44.71 U1.17 | 31.05,42.46 28.8,44.71
  Top 0.406: 25,52 25,52.2 21.4,55.8 21.4,60 21.8,60 | 20.2,60 19.2,59 | 31,44.71 28.8,44.71 28.2,45.31 28.2,50.8
  Top 0.61: 27.4,57.16 U3.5
SW1
  Top 0.305: U1.27 49.8,47.8 52,45.6 60.2,45.6 61,44.8 61,19.6 59.8,18.4 56.44,18.4 | R20.2 53.76,20.8
  Top 0.406: 53.76,20.8 S1.2 56.44,18.4
SW2
  Top 0.305: U1.26 49.6,47 51.8,44.8 59.6,44.8 60.2,44.2 60.2,27 59,25.8 56.44,25.8 | S2.2 53.76,28 R21.2
  Top 0.406: S2.2 56.44,25.8
SW3
  Top 0.305: 53.55,35.6 S3.2 | 56.44,33.2 58.4,33.2 59.4,34.2 59.4,43.4 58.8,44 51.6,44 49.4,46.2 U1.25
  Top 0.406: R22.2 53.55,35.6 | S3.2 56.44,33.2
TXO
  Top 0.406: JP1.2 65.14,49 63,49 62.2,48.2 53.2,48.2 52.6,48.8 52.6,50.4 52,51 U1.31
VBAT
  Top 0.61: JP2.1 JP3.1 8.5,13 9.5,14 13,14 14.6,15.6 18.6,15.6 19.2,15 19.2,13.9 C9.1 20.67,12.43 20.67,11.17 | 20.67,11.17 U6.8 | U6.5 23.7,7.09 24.6,8 24.6,10 23.43,11.17 20.67,11.17
VBAT_DETECT  (via drill 0.5)
  Top 0.305: 47.8,10.6 47.8,13.14 | 48.2,10.2 50.4,10.2 | 50.4,10.2 v61.8,10.2 | 50.4,10.2 C17.1 | v61.8,16.2 61.8,45.4 60.8,46.4 52.4,46.4 50.2,48.6 U1.28
  Top 0.406: R8.2 47.8,10.6 48.2,10.2 | 47.8,13.14 R19.1
  Bottom 0.305: v61.8,10.2 v61.8,16.2
VIN
  Top 0.61: JP2.2 3,10.2 4.8,8.4 6.4,8.4 8.4,6.4 8.4,2.8 9,2.2 21.6,2.2 25.4,6 C6.1 26.4,6.8 28.65,6.8 | 38.45,3.8 C28.1 38.65,3.8 U11.3 36.94,6.74 arc-90 37,6.8 | 30.55,6.8 U12.3 32.25,3.8 C33.1 | 28.65,6.8 U12.1 | 28.65,6.8 30.55,6.8 | C8.1 45.05,3.8 U5.3 43.55,6.8 | 41.65,6.8 U5.1 | 30.55,6.8 35,6.8 | 35,6.8 37,6.8 | 37,6.8 41.65,6.8 | 41.65,6.8 43.55,6.8 | U11.1 35.04,6.76 arc90 35,6.8 | 43.55,6.8 47.2,6.8 47.8,7.4 R8.1
VS_DREQ  (via drill 0.4)
  Top 0.305: U9.8 30.55,23.45 v31,23
  Top 0.406: U1.10 37.4,51 v36.6,51
  Bottom 0.406: v36.6,51 36.2,50.6 36.2,34.4 36.8,33.8 36.8,31 30.8,25 30.8,23.2 v31,23
VS_RX
  Top 0.305: U9.26 32.05,34.85 33.4,36.2 33.4,37.79 JP5.3 35.83,40.26 R12.2
VS_TX
  Top 0.305: U9.27 31.55,35.35 31.8,35.6 31.8,38.77 JP5.2
VS_XTALI
  Top 0.305: U9.18 37.15,29.55 arc90 37.2,29.6
  Top 0.406: 37.2,29.6 38.94,29.6 arc-90 R11.1 39,29.95 41.45,29.95 Q2.P$2 42.65,29.95 C16.2
VS_XTALO
  Top 0.305: U9.17 35.55,29.05 36.4,28.2 37.26,28.2
  Top 0.406: 37.26,28.2 38.46,28.2 arc-90 R11.2 39.46,27.2 42,27.2 | 42,27.2 Q2.P$1 | 42,27.2 42.05,27.25 C15.2
XCS  (via drill 0.4)
  Top 0.305: U9.23 35.85,32.05 v36,32.2
  Top 0.406: U1.12 36.2,49.4 v35.2,50.4
  Bottom 0.406: v35.2,50.4 35.2,33 v36,32.2
XDCS  (via drill 0.4)
  Top 0.305: U9.13 34.6,27.05 34.6,27 v33.8,26.2
  Top 0.4: v37.8,50.2 U1.11
  Bottom 0.406: v37.8,50.2 37.2,49.6 37.2,35 37.8,34.4 37.8,30.2 v33.8,26.2
XRESET  (via drill 0.4, 0.5)
  Top 0.305: U9.3 28.05,24.65 28,24.6 v26.4,24.6
  Top 0.4: 45.8,40.2 U1.23
  Top 0.406: v43.6,36.8 44.8,36.8 45.8,37.8 45.8,40.2 45.91,40.31 48.06,40.31 48.15,40.22 C12.2
  Top 0.61: 48.06,40.31 R13.2
  Bottom 0.406: v43.6,36.8 40,36.8 38.8,35.6 38.8,29.4 31.2,21.8 30.8,21.8 28,24.6 v26.4,24.6

### Text on the board
Top: 1
Bottom: 2
tmine: playa rev 0.1 Petre Rodan 201204 | activity | D43868 | . | IR sig | grn | . | txo | rxi | 3v3 | gnd | gnd | tx | gnd | rx | . | +3.7v | . | gnd | charging | full